# Altium project Z80-ays.PrjPcb
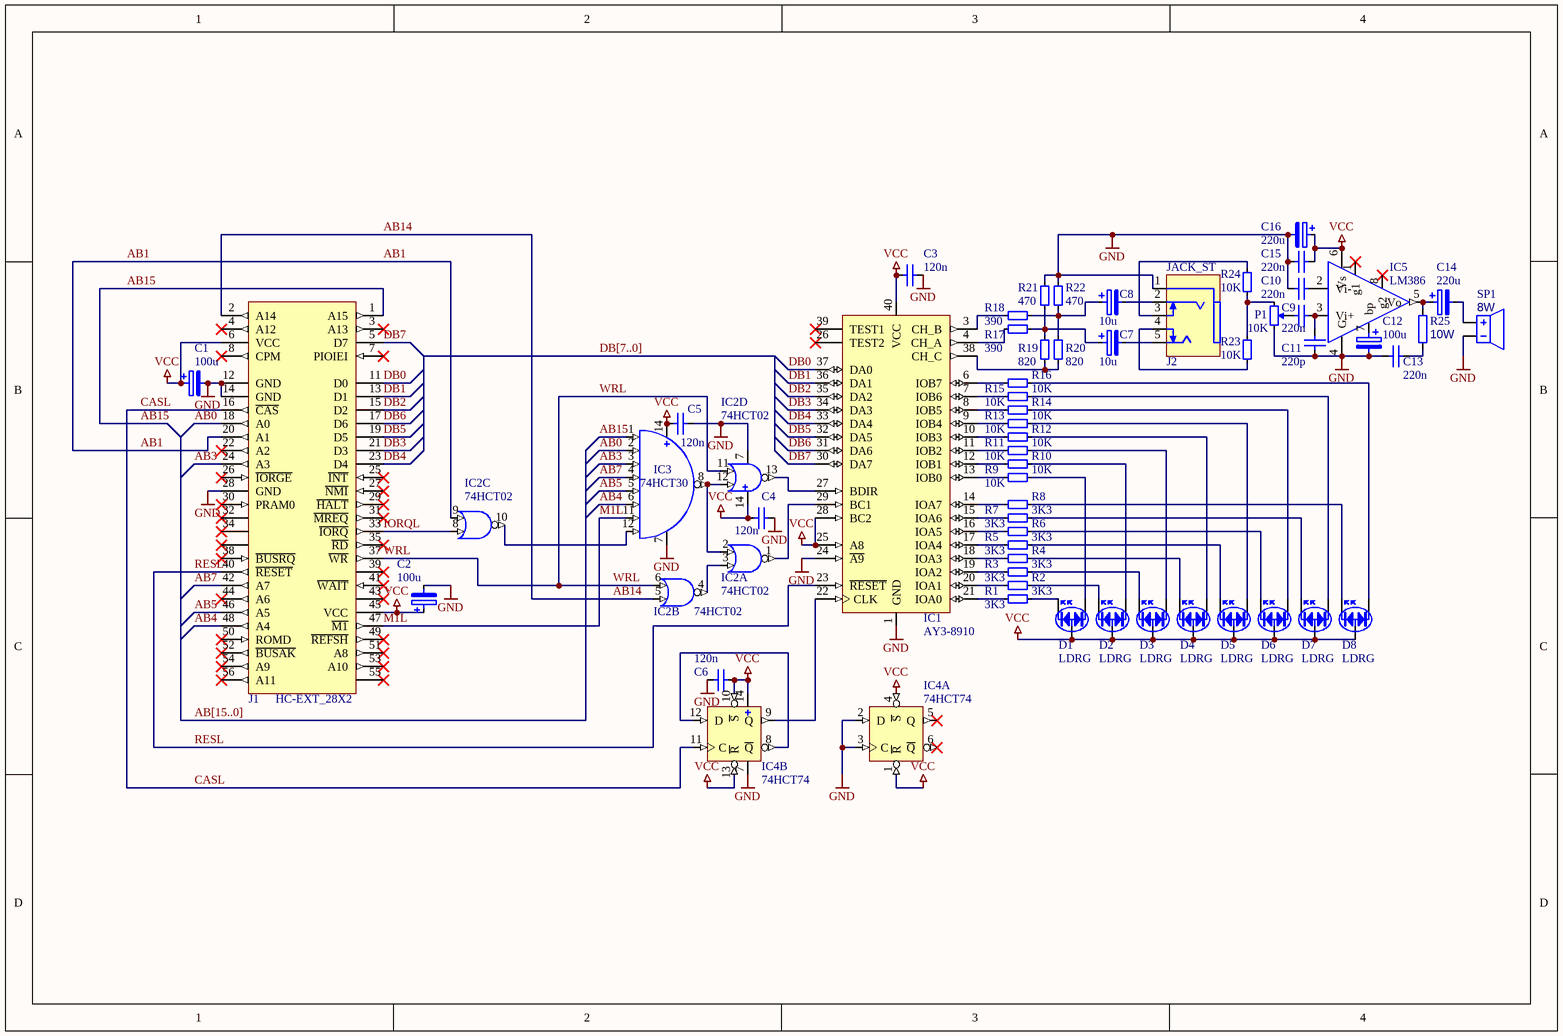
[diagram p0: Z80-ays.SchDoc]
1 sheet, 58 parts. Net scope: global (net labels, ports and power ports of the same name join across sheets).
Board file: Z80-ays.PcbDoc

## Sheet Z80-ays.SchDoc
size A4; SheetNumber: 0; SheetTotal: 0

### Parts
C1  100u  [C-ELKO_2D6L11.7]
C2  100u  [C-ELKO_2D6L11.7]
C3  120n  [C-CER_0.2W2.5L7]
C4  120n  [C-CER_0.2W2.5L7]
C5  120n  [C-CER_0.2W2.5L7]
C6  120n  [C-CER_0.2W2.5L7]
C7  10u  [C-ELKO_0.1D5]
C8  10u  [C-ELKO_0.1D5]
C9  220n  [C-FILM_0.2W5L7.5]
C10  220n  [C-FILM_0.2W5L7.5]
C11  220p  [C-CER_0.1W2L4.8]
C12  100u  [C-ELKO_2D6L11.7]
C13  220n  [C-FILM_0.2W5L7.5]
C14  220u  [C-ELKO_2D6L11.7]
C15  220n  [C-FILM_0.2W5L7.5]
C16  220u  [C-ELKO_2D6L11.7R]
D1  LDRG  [LED_0.1X2D5]
D2  LDRG  [LED_0.1X2D5]
D3  LDRG  [LED_0.1X2D5]
D4  LDRG  [LED_0.1X2D5]
D5  LDRG  [LED_0.1X2D5]
D6  LDRG  [LED_0.1X2D5]
D7  LDRG  [LED_0.1X2D5]
D8  LDRG  [LED_0.1X2D5]
IC1  AY3-8910  [IC40_DIP_W]
IC2  74HCT02  [IC14_DIP]  (parts A,B,C,D of 4)
IC3  74HCT30  [IC14_DIP]
IC4  74HCT74  [IC14_DIP]  (parts A,B of 2)
IC5  LM386  [IC8_DIP]
J1  HC-EXT_28X2  [ISA_TH/SMD_28X2]
J2  JACK_ST  [JACK_ST_SW]
P1  10K  [POT-B_10x10]
R1  3K3  [AXIAL_0.3D2]
R2  3K3  [AXIAL_0.3D2]
R3  3K3  [AXIAL_0.3D2]
R4  3K3  [AXIAL_0.3D2]
R5  3K3  [AXIAL_0.3D2]
R6  3K3  [AXIAL_0.3D2]
R7  3K3  [AXIAL_0.3D2]
R8  3K3  [AXIAL_0.3D2]
R9  10K  [AXIAL_0.3D2]
R10  10K  [AXIAL_0.3D2]
R11  10K  [AXIAL_0.3D2]
R12  10K  [AXIAL_0.3D2]
R13  10K  [AXIAL_0.3D2]
R14  10K  [AXIAL_0.3D2]
R15  10K  [AXIAL_0.3D2]
R16  10K  [AXIAL_0.3D2]
R17  390  [AXIAL_0.3D2]
R18  390  [AXIAL_0.3D2]
R19  820  [AXIAL_0.3D2]
R20  820  [AXIAL_0.3D2]
R21  470  [AXIAL_0.3D2]
R22  470  [AXIAL_0.3D2]
R23  10K  [AXIAL_0.3D2]
R24  10K  [AXIAL_0.3D2]
R25  10W  [AXIAL_0.45D3.5]
SP1  8W  [SPKR_8.8D23]

### Nets
GND: C1.2 C2.2 C3.2 C4.2 C5.2 C6.2 C10.2 C11.2 C12.2 C13.1 C15.2 C16.2 IC1.1(GND) IC1.24(~{A9}) IC2.7 IC3.7 IC4.2(D) IC4.3(C) IC4.7 IC5.4(G) J1.12(GND) J1.14(GND) J1.28(GND) J2.1 P1.2 R21.2 R22.2 SP1.2
VCC: C1.1 C2.1 C3.1 C4.1 C5.1 C6.1 C15.1 C16.1 D1.A D2.A D3.A D4.A D5.A D6.A D7.A D8.A IC1.25(A8) IC1.28(BC2) IC1.40(VCC) IC2.14 IC3.14 IC4.1(~{R}) IC4.4(~{S}) IC4.10(~{S}) IC4.13(~{R}) IC4.14 IC5.6(Vs) J1.6(VCC) J1.45(VCC)
AB0: IC3.2 J1.18(A0)
AB1: IC2.9 J1.20(A1)
AB3: IC3.3 J1.24(A3)
AB4: IC3.6 J1.48(A4)
AB5: IC3.5 J1.46(A5)
AB7: IC3.4 J1.42(A7)
AB14: IC2.5 J1.2(A14)
AB15: IC3.1 J1.1(A15)
CASL: IC4.11(C) J1.16(~{CAS})
DB0: IC1.37(DA0) J1.11(D0)
DB1: IC1.36(DA1) J1.13(D1)
DB2: IC1.35(DA2) J1.15(D2)
DB3: IC1.34(DA3) J1.21(D3)
DB4: IC1.33(DA4) J1.23(D4)
DB5: IC1.32(DA5) J1.19(D5)
DB6: IC1.31(DA6) J1.17(D6)
DB7: IC1.30(DA7) J1.5(D7)
IORQL: IC2.8 J1.33(~{IORQ})
M1L: IC3.11 J1.47(~{M1})
RESL: IC1.23(~{RESET}) J1.40(~{RESET})
WRL: IC2.6 IC2.11 J1.37(~{WR})
NetC7_1: C7.1 R17.2 R19.2 R21.1
NetC7_2: C7.2 J2.5
NetC8_1: C8.1 R18.2 R20.2 R22.1
NetC8_2: C8.2 J2.2
NetC9_1: C9.1 P1.3
NetC9_2: C9.2 C11.1 IC5.3(Vi+)
NetC10_1: C10.1 IC5.2(Vi-)
NetC12_1: C12.1 IC5.7(bp)
NetC13_2: C13.2 R25.2
NetC14_1: C14.1 IC5.5(Vo) R25.1
NetC14_2: C14.2 SP1.1
NetD1_K1: D1.K1 R1.2
NetD1_K2: D1.K2 R9.2
NetD2_K1: D2.K1 R2.2
NetD2_K2: D2.K2 R10.2
NetD3_K1: D3.K1 R3.2
NetD3_K2: D3.K2 R11.2
NetD4_K1: D4.K1 R4.2
NetD4_K2: D4.K2 R12.2
NetD5_K1: D5.K1 R5.2
NetD5_K2: D5.K2 R13.2
NetD6_K1: D6.K1 R6.2
NetD6_K2: D6.K2 R14.2
NetD7_K1: D7.K1 R7.2
NetD7_K2: D7.K2 R15.2
NetD8_K1: D8.K1 R8.2
NetD8_K2: D8.K2 R16.2
NetIC1_3: IC1.3(CH_B) R18.1
NetIC1_4: IC1.4(CH_A) R17.1
NetIC1_6: IC1.6(IOB7) R16.1
NetIC1_7: IC1.7(IOB6) R15.1
NetIC1_8: IC1.8(IOB5) R14.1
NetIC1_9: IC1.9(IOB4) R13.1
NetIC1_10: IC1.10(IOB3) R12.1
NetIC1_11: IC1.11(IOB2) R11.1
NetIC1_12: IC1.12(IOB1) R10.1
NetIC1_13: IC1.13(IOB0) R9.1
NetIC1_14: IC1.14(IOA7) R8.1
NetIC1_15: IC1.15(IOA6) R7.1
NetIC1_16: IC1.16(IOA5) R6.1
NetIC1_17: IC1.17(IOA4) R5.1
NetIC1_18: IC1.18(IOA3) R4.1
NetIC1_19: IC1.19(IOA2) R3.1
NetIC1_20: IC1.20(IOA1) R2.1
NetIC1_21: IC1.21(IOA0) R1.1
NetIC1_22: IC1.22(CLK) IC4.9(Q)
NetIC1_27: IC1.27(BDIR) IC2.13
NetIC1_29: IC1.29(BC1) IC2.1
NetIC1_38: IC1.38(CH_C) R19.1 R20.1
NetIC2_2: IC2.2 IC2.12 IC3.8
NetIC2_3: IC2.3 IC2.4
NetIC2_10: IC2.10 IC3.12
NetIC4_8: IC4.8(~{Q}) IC4.12(D)
NetJ2_3: J2.3 R24.2
NetJ2_4: J2.4 R23.1
NetP1_1: P1.1 R23.2 R24.1

Not connected (* = marked no-connect by the designer): IC1 26(TEST2)* 39(TEST1)*; IC4 5(Q)* 6(~{Q})*; IC5 1(g1)* 8(g2)*; J1 3(A13)* 4(A12)* 7(PIOIEI)* 8(CPM)* 22(A2)* 25(~{INT})* 26(~{IORGE})* 27(~{NMI})* 29(~{HALT})* 30(PRAM0)* 31(~{MREQ})* 32* 34* 35(~{RD})* 36* 38(~{BUSRQ})* 39* 41(~{WAIT})* 43* 44(A6)* 49(~{REFSH})* 50(ROMD)* 51(A8)* 52(~{BUSAK})* 53(A10)* 54(A9)* 55* 56(A11)*

### Buses and harness runs
bus AB[15..0]
bus DB[7..0]

### Library data of the parts
C1 C2 C7 C8 C12 C14 C16 = C-ELKO_20MIL
C3-C6 C9-C11 C13 C15 = CAP_20MIL
D1-D8 = LED_AKK
J2 = JACK_ST_SW
P1 = POT-20MIL
R1-R24 = RES-20MIL
R25 = RES-30MIL
SP1 = SPEAKER